# Altium schematic sheet IRBeaconBlasterSchematic.SchDoc
size A
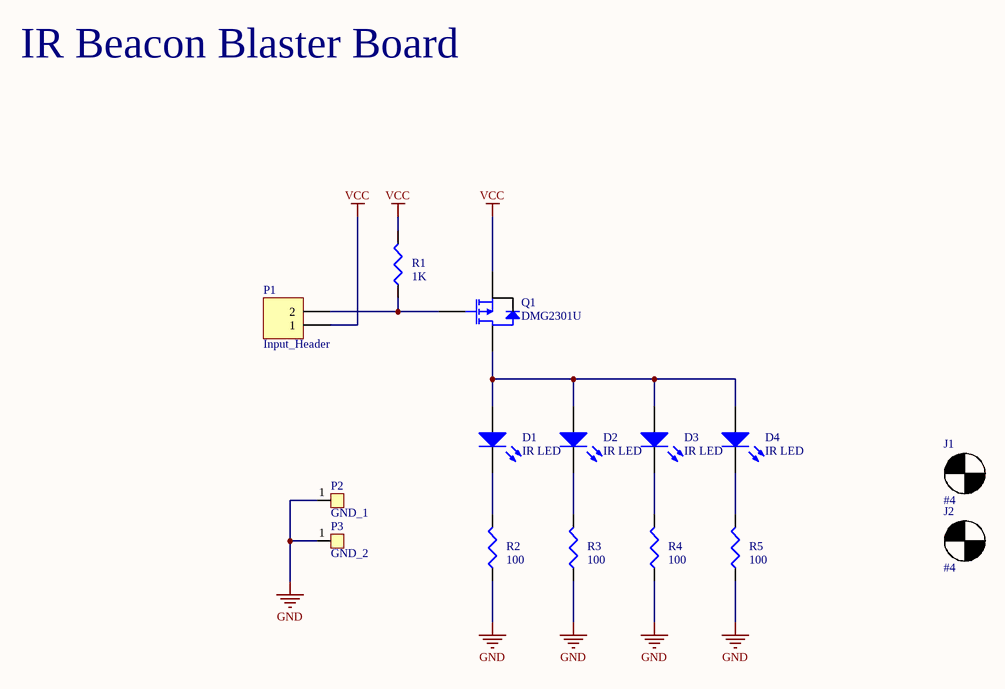
[diagram p0: IRBeaconBlasterSchematic.SchDoc]

## Parts
D1  IR LED  [LED_PTH_3mm]
D2  IR LED  [LED_PTH_3mm]
D3  IR LED  [LED_PTH_3mm]
D4  IR LED  [LED_PTH_3mm]
J1  #4  [#4_Screw_Hole]
J2  #4  [#4_Screw_Hole]
P1  Input_Header  [HDR1X2]
P2  GND_1  [HDR1X1]
P3  GND_2  [HDR1X1]
Q1  DMG2301U  [SOT-23]
R1  1K  [J1-0603]
R2  value 100  [J1-0603]  (hidden comment: Res3)
R3  value 100  [J1-0603]  (hidden comment: Res3)
R4  value 100  [J1-0603]  (hidden comment: Res3)
R5  value 100  [J1-0603]  (hidden comment: Res3)

## Nets
GND: P2.1 P3.1 R2.1 R3.1 R4.1 R5.1
VCC: P1.1 Q1.2(S) R1.2
NetD1_1: D1.1(A) D2.1(A) D3.1(A) D4.1(A) Q1.3(D)
NetD1_2: D1.2(K) R2.2
NetD2_2: D2.2(K) R3.2
NetD3_2: D3.2(K) R4.2
NetD4_2: D4.2(K) R5.2
NetP1_2: P1.2 Q1.1(G) R1.1

## Notes on the sheet
- IR Beacon Blaster Board

## Library data of the parts
D1-D4 = LED
J1 J2 = Mechanical_Hole: A mechanical hole for mounting the board
P1 = Header 2: Header, 2-Pin; LatestRevisionDate: 17-Jul-2002; LatestRevisionNote: Re-released for DXP Platform.; Publisher: Altium Limited
P2 P3 = Header 1x1
Q1 = P-Mosfet
R1-R5 = Res3: Resistor; Published: 8-Jun-2000; LatestRevisionDate: 29-May-2009; LatestRevisionNote: IPC-7351 Footprint Added.; PackageReference: J1-0603; Publisher: Altium Limited; PackageDescription: Chip Resistor
  R1: Value: 1K